# Altium schematic sheet [3] Connectors.SchDoc
size A4
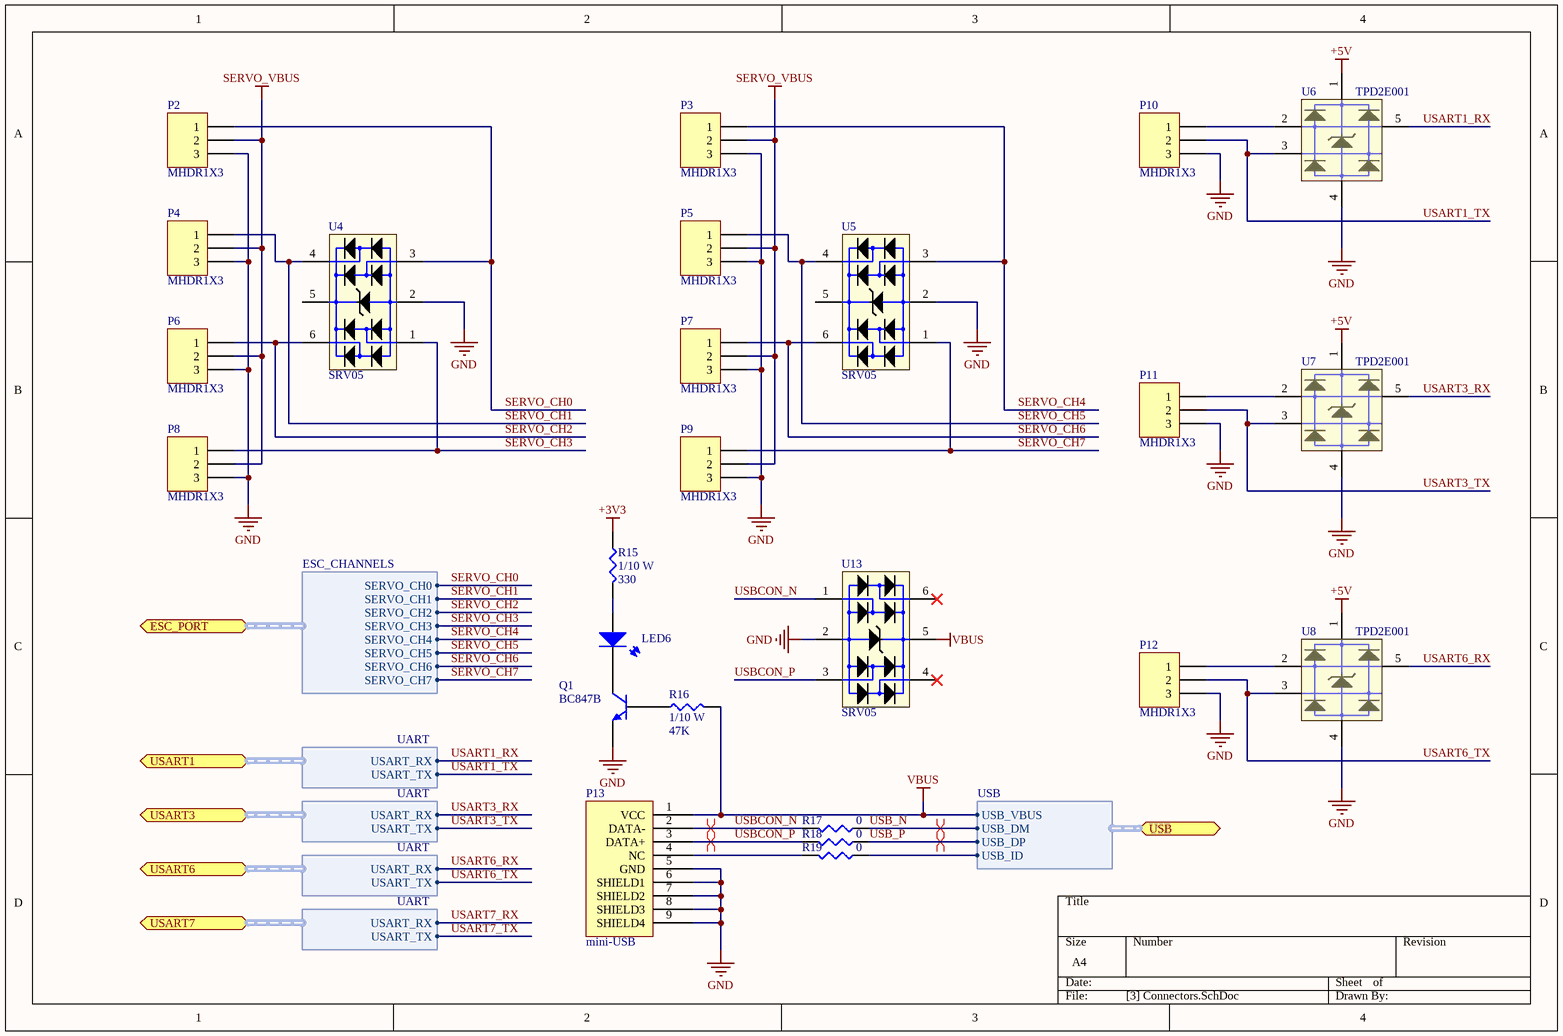
[diagram p0: [3] Connectors.SchDoc]

## Parts
LED6  LED 0603  [LED 0603]  (value not drawn)
P2  MHDR1X3  [MHDR1X3]
P3  MHDR1X3  [MHDR1X3]
P4  MHDR1X3  [MHDR1X3]
P5  MHDR1X3  [MHDR1X3]
P6  MHDR1X3  [MHDR1X3]
P7  MHDR1X3  [MHDR1X3]
P8  MHDR1X3  [MHDR1X3]
P9  MHDR1X3  [MHDR1X3]
P10  MHDR1X3  [MHDR1X3]
P11  MHDR1X3  [MHDR1X3]
P12  MHDR1X3  [MHDR1X3]
P13  mini-USB  [USB/SM0.8-6H5]
Q1  BC847B  [SOT23]
R15  value 330  Rating: 1/10 W  [RES0805]  (hidden comment: ChipRes 330R 1%)
R16  value 47K  Rating: 1/10 W  [RES0805]  (hidden comment: ChipRes 47K 1%)
R17  value 0  [RES0805]  (hidden comment: ChipRes)
R18  value 0  [RES0805]  (hidden comment: ChipRes)
R19  value 0  [RES0805]  (hidden comment: ChipRes)
U4  SRV05  [SOT23-6]
U5  SRV05  [SOT23-6]
U6  TPD2E001  [SOT23-5]
U7  TPD2E001  [SOT23-5]
U8  TPD2E001  [SOT23-5]
U13  SRV05  [SOT23-6]

## Ports
ESC_PORT (harness ESC_CHANNELS), USART1 (harness UART), USART3 (harness UART), USART6 (harness UART), USART7 (harness UART), USB (harness USB)

## Harnesses
ESC_CHANNELS: SERVO_CH0, SERVO_CH1, SERVO_CH2, SERVO_CH3, SERVO_CH4, SERVO_CH5, SERVO_CH6, SERVO_CH7
UART: USART_RX, USART_TX
USB: USB_DM, USB_DP, USB_ID, USB_VBUS

## Nets
+3V3: R15.1
+5V: U6.1 U7.1 U8.1
GND: P2.3 P3.3 P4.3 P5.3 P6.3 P7.3 P8.3 P9.3 P10.3 P11.3 P12.3 P13.5(GND) P13.6(SHIELD1) P13.7(SHIELD2) P13.8(SHIELD3) P13.9(SHIELD4) Q1.2(E) U4.2 U5.2 U6.4 U7.4 U8.4 U13.2
SERVO_VBUS: P2.2 P3.2 P4.2 P5.2 P6.2 P7.2 P8.2 P9.2
VBUS: P13.1(VCC) R16.2 U13.5 ; port USB.USB_VBUS
SERVO_CH0: P2.1 U4.3 ; port ESC_PORT.SERVO_CH0
SERVO_CH1: P4.1 U4.4 ; port ESC_PORT.SERVO_CH1
SERVO_CH2: P6.1 U4.6 ; port ESC_PORT.SERVO_CH2
SERVO_CH3: P8.1 U4.1 ; port ESC_PORT.SERVO_CH3
SERVO_CH4: P3.1 U5.3 ; port ESC_PORT.SERVO_CH4
SERVO_CH5: P5.1 U5.4 ; port ESC_PORT.SERVO_CH5
SERVO_CH6: P7.1 U5.6 ; port ESC_PORT.SERVO_CH6
SERVO_CH7: P9.1 U5.1 ; port ESC_PORT.SERVO_CH7
USART1_RX: U6.5 ; port USART1.USART_RX
USART1_TX: P10.2 U6.3 ; port USART1.USART_TX
USART3_RX: U7.5 ; port USART3.USART_RX
USART3_TX: P11.2 U7.3 ; port USART3.USART_TX
USART6_RX: U8.5 ; port USART6.USART_RX
USART6_TX: P12.2 U8.3 ; port USART6.USART_TX
USART7_RX: port USART7.USART_RX
USART7_TX: port USART7.USART_TX
USB_N: R17.1 ; port USB.USB_DM
USB_P: R18.1 ; port USB.USB_DP
USBCON_N: P13.2(DATA-) R17.2 U13.1
USBCON_P: P13.3(DATA+) R18.2 U13.3
NetLED6_1: LED6.1 Q1.1(C)
NetLED6_2: LED6.2 R15.2
NetP10_1: P10.1 U6.2
NetP11_1: P11.1 U7.2
NetP12_1: P12.1 U8.2
NetP13_4: P13.4(NC) R19.2
NetQ1_3: Q1.3(B) R16.1
NetR19_1: R19.1 ; port USB.USB_ID

Not connected (* = marked no-connect by the designer): U4 5; U5 5; U13 4* 6*

## Layout directives
differential pair: USB_N, USB_P, USBCON_N, USBCON_P

## Library data of the parts
LED6 = LED0603
P2-P12 = MHDR1X3: Header, 3-Pin; LatestRevisionDate: 17-Jul-2002; LatestRevisionNote: Re-released for DXP Platform.; Publisher: Altium Limited
P13 = miniUSB
Q1 = BC847B: SOT23 NPN Silicon Planar General Purpose Transistor; Published: 8-Jun-2000; LatestRevisionDate: 17-Jul-2002; LatestRevisionNote: Re-released for DXP Platform.; DatasheetVersion: Jan-1997; PackageVersion: 1996; PackageReference: SOT23; Publisher: Altium Limited; PackageDescription: SOT-23; 3 Leads; Body 3.1 x 2.5 mm, inc. leads (LxW max), Alternate Lead Configuration; ComponentLink1Description: Manufacturer Link; ComponentLink1URL: http://www.zetex.com/
R15 = ChipRes 330R 1%: Think Film Chip resistor; Temperature Coefficient: 200ppm/K; Tolerance: 1%; Type: ThickFilm
R16 = ChipRes 47K 1%: Think Film Chip resistor; Temperature Coefficient: 200ppm/K; Tolerance: 1%; Type: ThickFilm
R17-R19 = ChipRes: Chip resistor
U4 U5 U13 = SRV05: Protection 6V 10A
U6-U8 = TPD2E001: Low-Capacitance 2-Channel ESD-Protection for High-Speed Data Interfaces